# EAGLE design SA612Mixer_Simple (EAGLE 6.5.0)
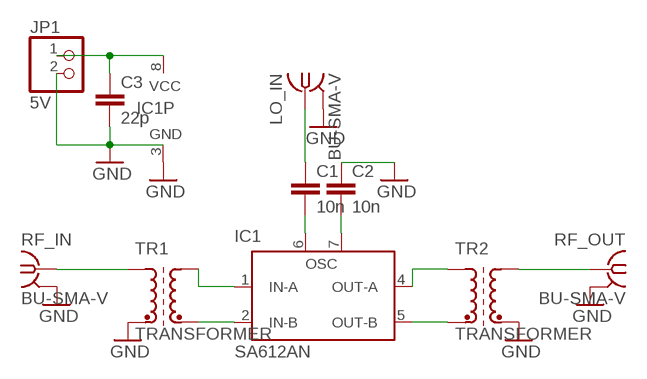
[diagram p0: schematic, sheet 1]

## Parts
C1  10n  C5/2.5  [C5B2.5]
C2  10n  C5/2.5  [C5B2.5]
C3  22p  C5/2.5  [C5B2.5]
IC1  SA612AN  [DIL08]
JP1  5V  PINHD-1X2  [1X02]
LO_IN  BU-SMA-V  [BU-SMA-V]
RF_IN  BU-SMA-V  [BU-SMA-V]
RF_OUT  BU-SMA-V  [BU-SMA-V]
TR1  TRANSFORMER  [TRANSFORMER1]
TR2  TRANSFORMER  [TRANSFORMER1]

## Nets
GND: C2.1 C3.2 IC1.3(GND) JP1.2 LO_IN.2 LO_IN.3 LO_IN.4 LO_IN.5 RF_IN.2 RF_IN.3 RF_IN.4 RF_IN.5 RF_OUT.2 RF_OUT.3 RF_OUT.4 RF_OUT.5 TR1.P$2(E1) TR2.P$4(E2)
N$1: C3.1 IC1.8(VCC) JP1.1
N$3: C1.2 IC1.6(OSC)
N$4: C1.1 LO_IN.1
N$5: C2.2 IC1.7(OSC')
N$6: IC1.2(IN-B) TR1.P$4(E2)
N$7: IC1.1(IN-A) TR1.P$3(A2)
N$8: IC1.4(OUT-A) TR2.P$1(A1)
N$9: IC1.5(OUT-B) TR2.P$2(E1)
N$10: RF_IN.1 TR1.P$1(A1)
N$11: RF_OUT.1 TR2.P$3(A2)

## Library data of the parts
C1-C3 = 0myLib:C: CAPACITOR naming: grid - package width
IC1 = 0myLib:SA612A: Double-balanced mixer and oscillator NE612/SA612 Source: www-eu2.semiconductors.philips.com/acrobat/datasheets/SA612A.pdf
JP1 = 0myLib:PINHD-1X2: PIN HEADER
LO_IN RF_IN RF_OUT = 0myLib:BU-SMA-V: FEMALE SMA CONNECTOR Radiall distributor RS 112-3794; OC_FARNELL: unknown; OC_NEWARK: unknown
TR1 TR2 = 0myLib:TRANSFORMER

## Board
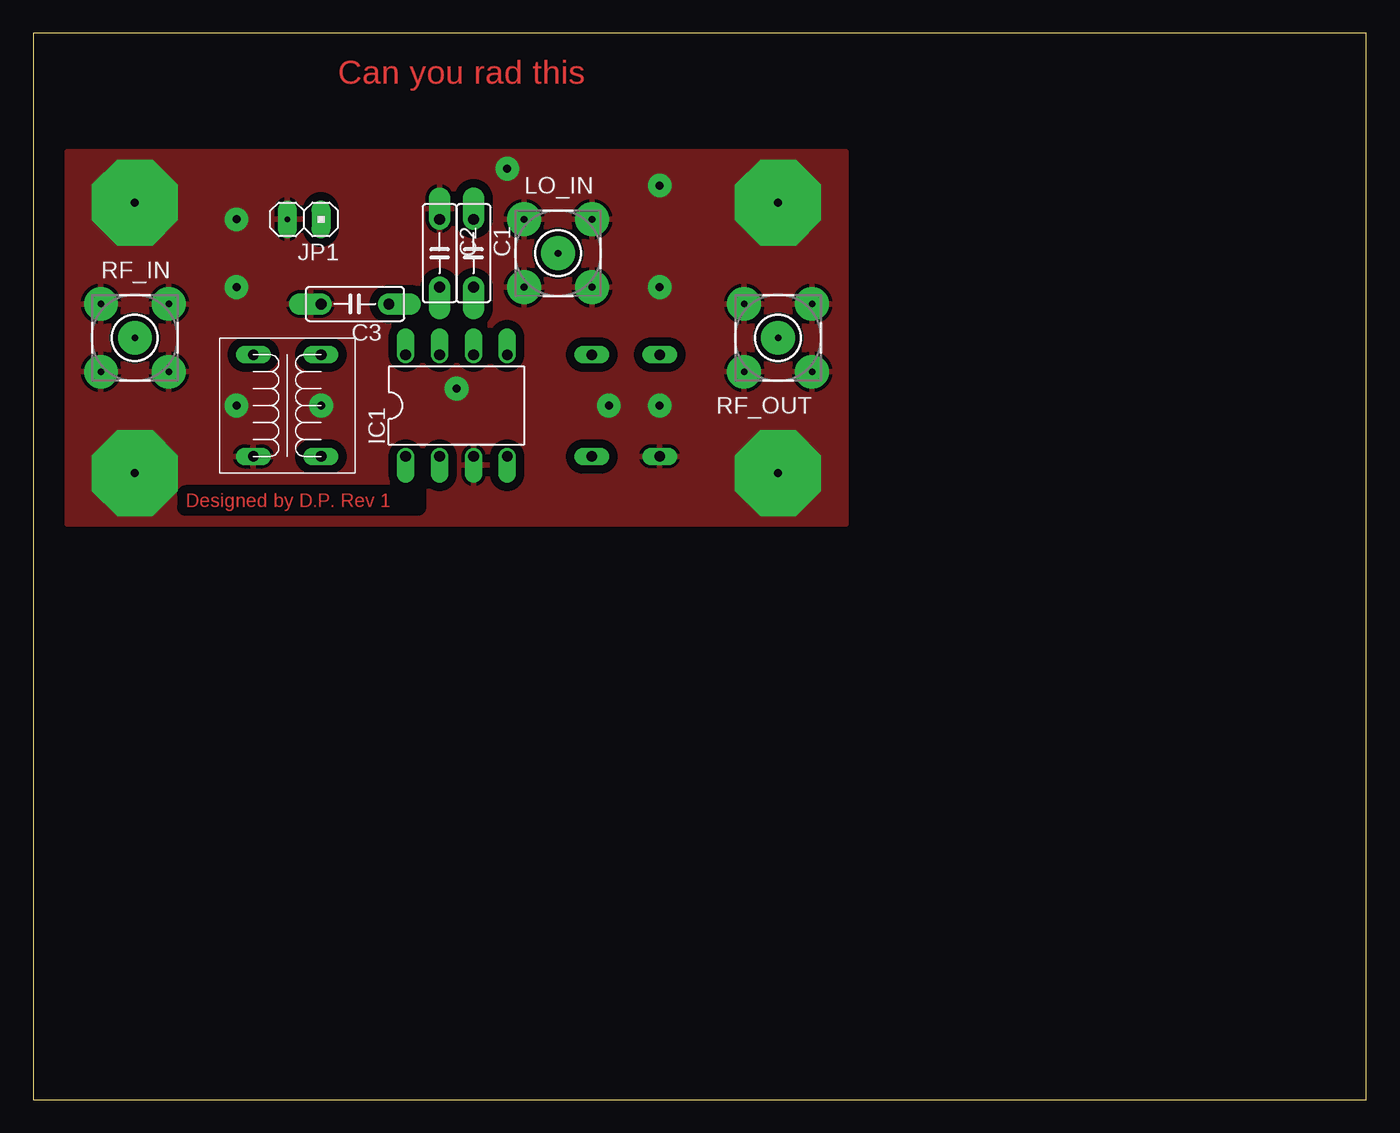
[diagram p1: board, top side]
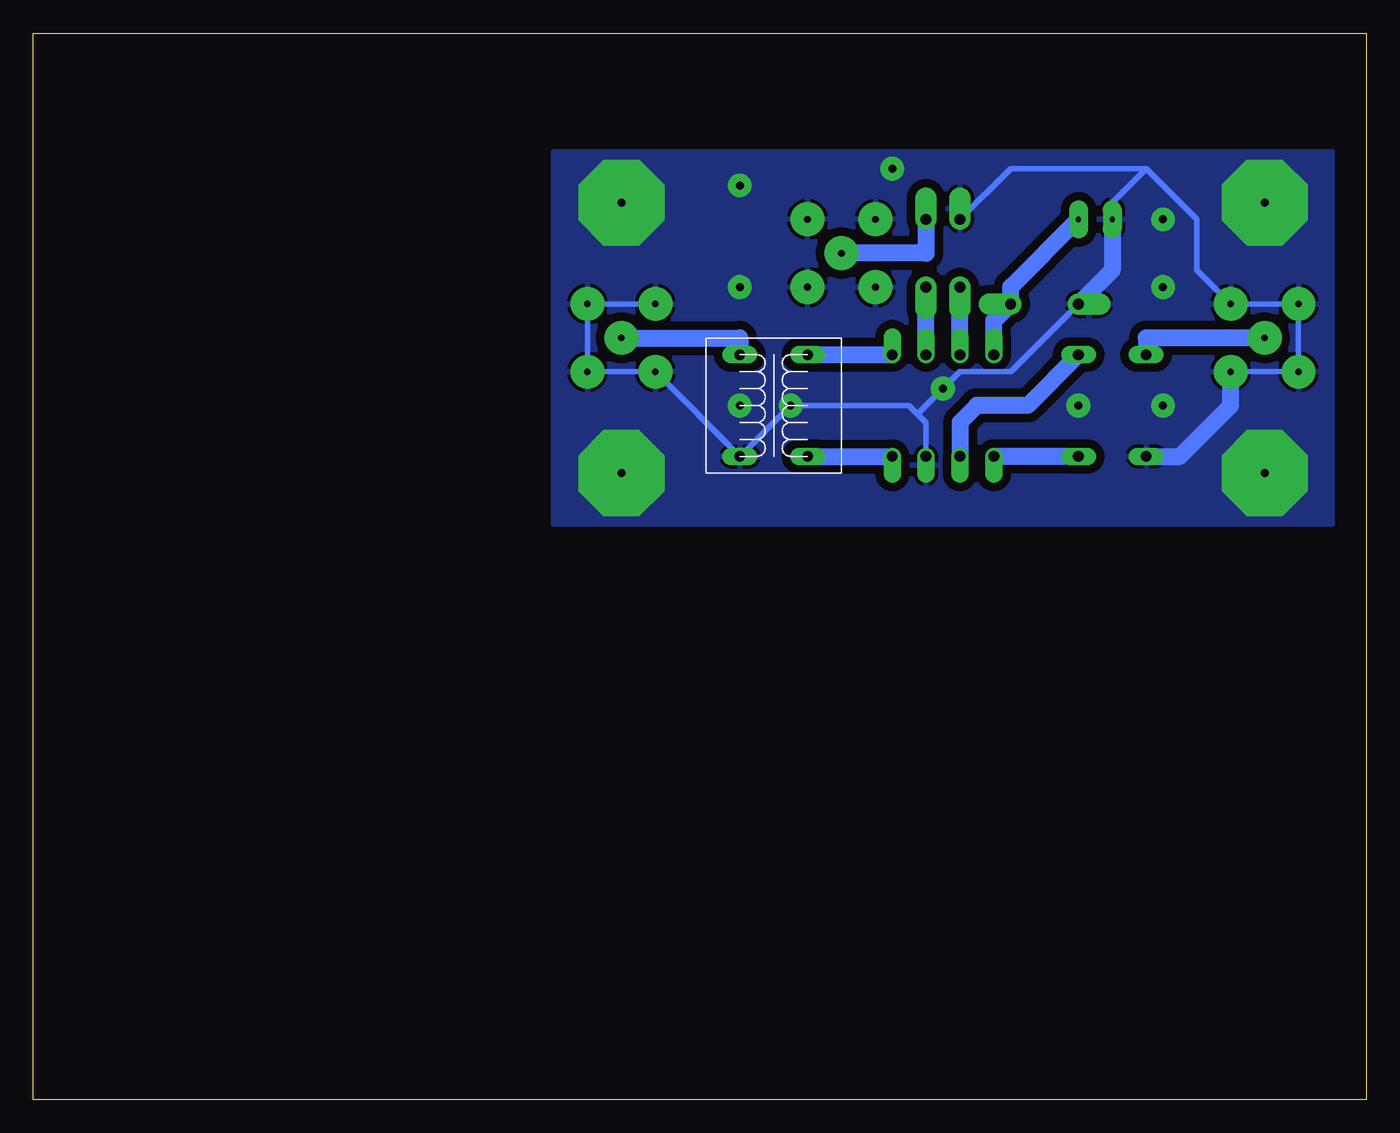
[diagram p2: board, bottom side, seen from below]

Size 100 x 80 mm. Coordinates in mm from the lower left corner, seen from the top.
Outline: 0,0 100,0 100,80 0,80 0,0
Copper layers (1*16): Top 0.035mm / dielectric 1.5mm / Bottom 0.035mm
Design rules "FinalizeAreaFill": minimum track width 12mil, minimum drill 1.4mm, track to track 25mil, track to pad 25mil, pad to pad 8mil, via to via 8mil, smd to smd 8mil, copper to edge 40mil, drill to drill 8mil, minimum pad ring 10mil, minimum via ring 8mil, stop-mask expansion 4mil, vias tented up to drill 0mil, thermal gap 10mil

### Footprints (pad centres in the part's own frame; a part is rotated, then mirrored left to right if it is on the bottom)
C5B2.5 = drill 0.813 pad 1.6 offset: 1 -2.54,0; 2 2.54,0
DIL08 = drill 0.813 pad 1.27 offset: 1 -3.81,-3.81; 2 -1.27,-3.81; 3 1.27,-3.81; 4 3.81,-3.81; 5 3.81,3.81; 6 1.27,3.81; 7 -1.27,3.81; 8 -3.81,3.81
1X02 = drill 0.4 pad 1.422 long: 1 -1.27,0; 2 1.27,0
BU-SMA-V = drill 0.5 pad 2.54: 1 0,0; 2 -2.55,2.55; 3 2.55,2.55; 4 2.55,-2.55; 5 -2.55,-2.55
TRANSFORMER1 = drill 0.8 long: P$1 -2.54,3.81; P$2 -2.54,-3.81; P$3 2.54,-3.81; P$4 2.54,3.81

### Placement (x,y rotation side)
C1  33.02,63.5 270 top
C2  30.48,63.5 270 top
C3  24.13,59.69 180 top
IC1  31.75,52.07 0 top
JP1  20.32,66.04 180 top
LO_IN  39.37,63.5 0 top
RF_IN  7.62,57.15 0 top
RF_OUT  55.88,57.15 180 top
TR1  19.05,52.07 0 top
TR2  44.45,52.07 180 bottom

### Tracks (layer width: path | path; a pad name or v marks a point on that pad's centre or on a via)
GND  (via drill 0.6 pad 1.78, 0.6 pad 6.45)
  Bottom 0.406: C2.1 26.67,69.85 16.51,69.85 | 16.51,69.85 12.7,66.04 12.7,62.23 RF_IN.3 | JP1.2 19.05,67.31 16.51,69.85 | IC1.3 33.02,50.8 33.66,51.44 | 33.66,51.44 34.29,52.07 v43.18,52.07 TR2.P$4 RF_OUT.3 RF_OUT.2 RF_OUT.5 RF_OUT.4 | RF_IN.4 RF_IN.5 RF_IN.2 5.09,59.7 RF_IN.3 | RF_IN.2 RF_IN.3 | C3.2 26.67,54.61 30.48,54.61 v31.75,53.34 33.66,51.44
  Bottom 1.27: TR1.P$2 13.97,48.26 10.16,52.07 RF_IN.4 | C3.2 19.05,62.23 JP1.2
  other vias: 15.24,66.04 15.24,60.96 15.24,52.07 21.59,52.07 35.56,69.85 46.99,68.58 46.99,60.96 46.99,52.07 7.62,67.31 7.62,46.99 55.88,67.31 55.88,46.99
  pour Bottom: 2.54,43.18 2.54,71.12 60.96,71.12 60.96,43.18
  pour Top: 2.54,71.12 2.54,43.18 60.96,43.18 60.96,71.12
N$1
  Bottom 1.27: IC1.8 27.94,58.42 C3.1 26.67,60.96 JP1.1
N$3
  Bottom 1.27: IC1.6 C1.2
N$4
  Bottom 1.27: C1.1 33.02,63.5 LO_IN.1
N$5
  Bottom 1.27: IC1.7 C2.2
N$6
  Bottom 1.27: TR1.P$4 25.4,52.07 29.21,52.07 30.48,50.8 IC1.2
N$7
  Bottom 1.27: TR1.P$3 IC1.1
N$8
  Bottom 1.27: TR2.P$1 IC1.4
N$9
  Bottom 1.27: TR2.P$2 IC1.5
N$10
  Bottom 1.27: RF_IN.1 16.51,57.15 TR1.P$1
N$11
  Bottom 1.27: RF_OUT.1 46.99,57.15 TR2.P$3

### Text on the board
Top: Can you rad this | Designed by D.P. Rev 1